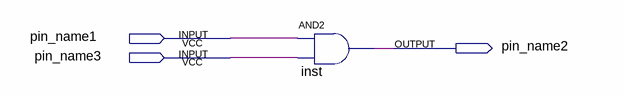
[diagram p0: schematic sheet]
// Quartus schematic bruh.bdf as structural Verilog: 1 symbols, 3 pins
module bruh (
  input  pin_name1,
  input  pin_name3,
  output pin_name2
);

  and inst (pin_name2, pin_name1, pin_name3);
endmodule
